# Altium schematic sheet Oscar_MainBoard_Analog.SchDoc
size A4
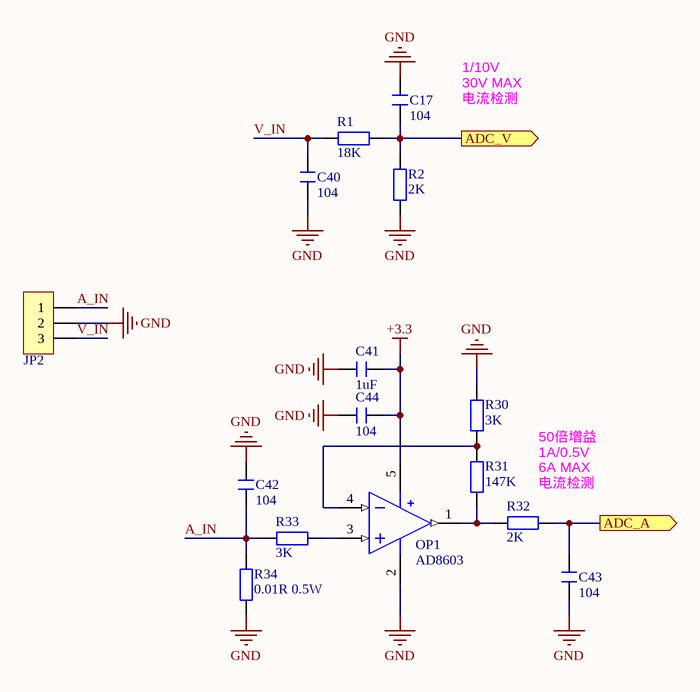
[diagram p0: Oscar_MainBoard_Analog.SchDoc]

## Parts
C17  104  [C 0402_L]
C40  104  [C 0402_L]
C41  1uF  [C 0402_L]
C42  104  [C 0402_L]
C43  104  [C 0402_L]
C44  104  [C 0402_L]
JP2  HDR-1X3  [MX 1.25-WS-3P]  (value not drawn)
OP1  AD8603  [SOT23-5N]
R1  18K  [R 0402_L]
R2  2K  [R 0402_L]
R30  3K  [R 0402_L]
R31  147K  [R 0402_L]
R32  2K  [R 0402_L]
R33  3K  [R 0402_L]
R34  0.01R 0.5W  [R 0805_L]

## Ports
ADC_A (out), ADC_V (out)

## Nets
+3.3: C41.1 C44.1 OP1.5(VCC)
GND: C17.1 C40.2 C41.2 C42.1 C43.2 C44.2 JP2.2 OP1.2(VEE) R2.2 R30.2 R34.2
A_IN: C42.2 JP2.1 R33.1 R34.1
ADC_A: C43.1 R32.1 ; port ADC_A
ADC_V: C17.2 R1.2 R2.1 ; port ADC_V
V_IN: C40.1 JP2.3 R1.1
NetOP1_1: OP1.1(OUT) R31.1 R32.2
NetOP1_3: OP1.3(IN+) R33.2
NetOP1_4: OP1.4(IN-) R30.1 R31.2

## Notes on the sheet
- 电流检测
- 1/10V
- 30V MAX
- 50倍增益
- (near R32) 电流检测
- 1A/0.5V
- 6A MAX

## Library data of the parts
C17 C40-C44 = C: 贴片电容; BOM名称: 无极性贴片电容; 优秀评价可免费更新: 联系淘宝ID：黄晶宝石，获取更新版封装库; 卖家免费技术支持，联系售后: 唯一出售店铺网址https://shop463601444.taobao.com; 本封装库来自淘宝卖家 ID：黄晶宝石: 其他店铺购入均为盗版，请立即申请退款
JP2 = Header 3: 3P接插件; 卖家免费技术支持，联系售后: 唯一出售店铺网址https://shop463601444.taobao.com; 封装库来自淘宝卖家 ID：黄晶宝石: 其他店铺购入均为假冒，请申请退款，本店现金奖励; 优秀评价可免费更新封装库: 联系淘宝ID：黄晶宝石，获取更新版封装库; BOM名称: 3P接插件
OP1 = AD8603: 精密低功耗轨对轨
R1 R2 R30-R34 = R: 贴片电阻; 优秀评价可免费更新: 联系淘宝ID：黄晶宝石，获取更新版封装库; 卖家免费技术支持，联系售后: 唯一出售店铺网址https://shop463601444.taobao.com; 本封装库来自淘宝卖家 ID：黄晶宝石: 其他店铺购入均为盗版，请立即申请退款; BOM名称: 贴片电阻